# Altium schematic sheet MCU.SchDoc
size A4; SheetNumber: 7; SheetTotal: 9
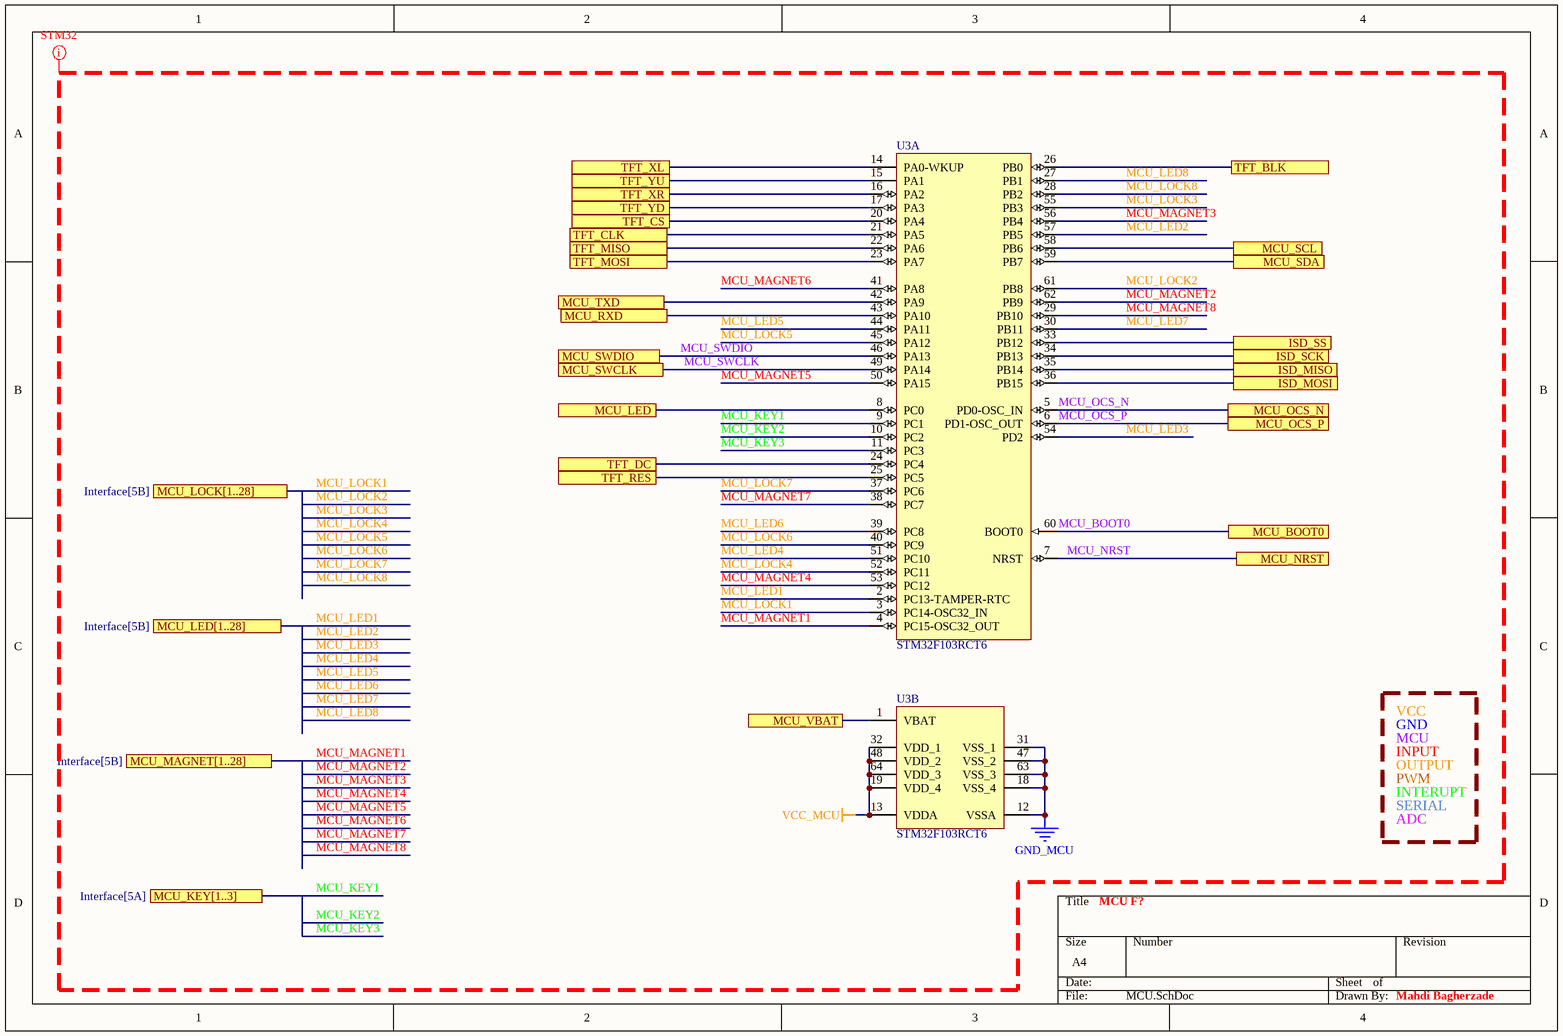
[diagram p0: MCU.SchDoc]

## Parts
U3  STM32F103RCT6  [STM-LQFP64_N]  (parts A,B of 2)

## Ports
ISD_MISO (see Interface[7B], ISD1730[1B]), ISD_MOSI (see Interface[7B], ISD1730[1B]), ISD_SCK (see Interface[7B], ISD1730[1B]), ISD_SS (see Interface[7B], ISD1730[1B]), MCU_BOOT0 (see Interface[7A], STM32_AUX[2B]), MCU_KEY[1..3] (see Interface[5A]), MCU_LED (see Interface[5B]), MCU_LED[1..28] (see Interface[5B]), MCU_LOCK[1..28] (see Interface[5B]), MCU_MAGNET[1..28] (see Interface[5B]), MCU_NRST (see Interface[7B], STM32_AUX[3A]), MCU_OCS_N (see Interface[7B], STM32_AUX[4A]), MCU_OCS_P (see Interface[7B], STM32_AUX[4A]), MCU_RXD (see Interface[7A]), MCU_SCL (see Interface[5A], EEPROM[3B]), MCU_SDA (see Interface[5A], EEPROM[3B]), MCU_SWCLK (see Interface[7A], STM32_AUX[2B]), MCU_SWDIO (see Interface[7A], STM32_AUX[2B]), MCU_TXD (see Interface[7A]), MCU_VBAT (see Interface[7B], STM32_AUX[1D]), TFT_BLK (see Interface[7C], LCD TFT 40 Pin[1B]), TFT_CLK (see Interface[7B], LCD TFT 40 Pin[1A]), TFT_CS (see Interface[7B], LCD TFT 40 Pin[1A]), TFT_DC (see Interface[7C], LCD TFT 40 Pin[1A]), TFT_MISO (see Interface[7B], LCD TFT 40 Pin[1A]), TFT_MOSI (see Interface[7B], LCD TFT 40 Pin[1A]), TFT_RES (see Interface[7C], LCD TFT 40 Pin[1B]), TFT_XL (see Interface[7C], LCD TFT 40 Pin[1B]), TFT_XR (see Interface[7C], LCD TFT 40 Pin[1B]), TFT_YD (see Interface[7C], LCD TFT 40 Pin[1B]), TFT_YU (see Interface[7C], LCD TFT 40 Pin[1B])

## Nets
GND_MCU: U3.12(VSSA) U3.18(VSS_4) U3.31(VSS_1) U3.47(VSS_2) U3.63(VSS_3)
VCC_MCU: U3.13(VDDA) U3.19(VDD_4) U3.32(VDD_1) U3.48(VDD_2) U3.64(VDD_3)
ISD_MISO: U3.35(PB14) ; port ISD_MISO
ISD_MOSI: U3.36(PB15) ; port ISD_MOSI
ISD_SCK: U3.34(PB13) ; port ISD_SCK
ISD_SS: U3.33(PB12) ; port ISD_SS
MCU_BOOT0: U3.60(BOOT0) ; port MCU_BOOT0
MCU_KEY1: U3.9(PC1)
MCU_KEY2: U3.10(PC2)
MCU_KEY3: U3.11(PC3)
MCU_LED: U3.8(PC0) ; port MCU_LED
MCU_LED1: U3.2(PC13-TAMPER-RTC)
MCU_LED2: U3.57(PB5)
MCU_LED3: U3.54(PD2)
MCU_LED4: U3.51(PC10)
MCU_LED5: U3.44(PA11)
MCU_LED6: U3.39(PC8)
MCU_LED7: U3.30(PB11)
MCU_LED8: U3.27(PB1)
MCU_LOCK1: U3.3(PC14-OSC32_IN)
MCU_LOCK2: U3.61(PB8)
MCU_LOCK3: U3.55(PB3)
MCU_LOCK4: U3.52(PC11)
MCU_LOCK5: U3.45(PA12)
MCU_LOCK6: U3.40(PC9)
MCU_LOCK7: U3.37(PC6)
MCU_LOCK8: U3.28(PB2)
MCU_MAGNET1: U3.4(PC15-OSC32_OUT)
MCU_MAGNET2: U3.62(PB9)
MCU_MAGNET3: U3.56(PB4)
MCU_MAGNET4: U3.53(PC12)
MCU_MAGNET5: U3.50(PA15)
MCU_MAGNET6: U3.41(PA8)
MCU_MAGNET7: U3.38(PC7)
MCU_MAGNET8: U3.29(PB10)
MCU_NRST: U3.7(NRST) ; port MCU_NRST
MCU_OCS_N: U3.5(PD0-OSC_IN) ; port MCU_OCS_N
MCU_OCS_P: U3.6(PD1-OSC_OUT) ; port MCU_OCS_P
MCU_RXD: U3.43(PA10) ; port MCU_RXD
MCU_SCL: U3.58(PB6) ; port MCU_SCL
MCU_SDA: U3.59(PB7) ; port MCU_SDA
MCU_SWCLK: U3.49(PA14) ; port MCU_SWCLK
MCU_SWDIO: U3.46(PA13) ; port MCU_SWDIO
MCU_TXD: U3.42(PA9) ; port MCU_TXD
MCU_VBAT: U3.1(VBAT) ; port MCU_VBAT
TFT_BLK: U3.26(PB0) ; port TFT_BLK
TFT_CLK: U3.21(PA5) ; port TFT_CLK
TFT_CS: U3.20(PA4) ; port TFT_CS
TFT_DC: U3.24(PC4) ; port TFT_DC
TFT_MISO: U3.22(PA6) ; port TFT_MISO
TFT_MOSI: U3.23(PA7) ; port TFT_MOSI
TFT_RES: U3.25(PC5) ; port TFT_RES
TFT_XL: U3.14(PA0-WKUP) ; port TFT_XL
TFT_XR: U3.16(PA2) ; port TFT_XR
TFT_YD: U3.17(PA3) ; port TFT_YD
TFT_YU: U3.15(PA1) ; port TFT_YU

## Layout directives
net class STM32: GND_MCU, MCU_BOOT0, MCU_KEY1, MCU_KEY2, MCU_KEY3, MCU_LED1, MCU_LED2, MCU_LED3, MCU_LED4, MCU_LED5, MCU_LED6, MCU_LED7, MCU_LED8, MCU_LOCK1, MCU_LOCK2, MCU_LOCK3, MCU_LOCK4, MCU_LOCK5, MCU_LOCK6, MCU_LOCK7, MCU_LOCK8, MCU_MAGNET1, MCU_MAGNET2, MCU_MAGNET3, MCU_MAGNET4, MCU_MAGNET5, MCU_MAGNET6, MCU_MAGNET7, MCU_MAGNET8, MCU_NRST, MCU_OCS_N, MCU_OCS_P, MCU_SWCLK, MCU_SWDIO, VCC_MCU

## Notes on the sheet
- VCC
- INPUT
- OUTPUT
- PWM
- MCU
- GND
- INTERUPT
- SERIAL
- ADC
- MCU F?
- Mahdi Bagherzade

## Library data of the parts
U3 = STM32F103RCT6: ARM Cortex-M3 32-bit MCU, 256 KB Flash, 48 KB Internal RAM, 51 I/Os, 64-pin LQFP, -40 to 85 degC, Tray; A/D Converter: 3x12-bit (16 Channel); D/A Converter: 2x12-bit (2 Channel); FLASH Size (Prog) (kB): 256; I/Os (High Current): 51; Internal RAM Size (kB): 48; Operating Frequency(F) (Processor speed) (MHz): 72; Supply Voltage(Vcc) min (V): 2; DatasheetVersion: Rev. 8; PackageVersion: Rev. 4, 06/2013; PackageReference: LQFP64; PackageDescription: 64-Pin Low Profile Quad Flat Package, 10 x 10 mm Body, 0.5 mm Pitch; Supplier 1: Digi-Key; Supplier Part Number 1: 497-9033-ND; Supplier 2: Newark; Supplier Part Number 2: 01P4099; Supplier 3: Newark; Supplier Part Number 3: 57P1227; Supplier 4: Mouser; Supplier Part Number 4: 511-STM32F103RCT6; Core: ARM Cortex-M3; Packing: Tray; Mounting Technology: Surface Mount; PartNumber: STM32F103RCT6; ComponentLink1Description: Manufacturer URL; ComponentLink1URL: http://www.st.com/web/en/home.html; ComponentLink2Description: Datasheet; ComponentLink2URL: http://www.st.com/st-web-ui/static/active/en/resource/technical/document/datasheet/CD00191185.pdf; ComponentLink3Description: Package Specification; ComponentLink3URL: http://www.st.com/st-web-ui/static/active/en/resource/technical/document/datasheet/DM00037051.pdf